# EAGLE design LTC2485Shield (EAGLE 7.4.0)
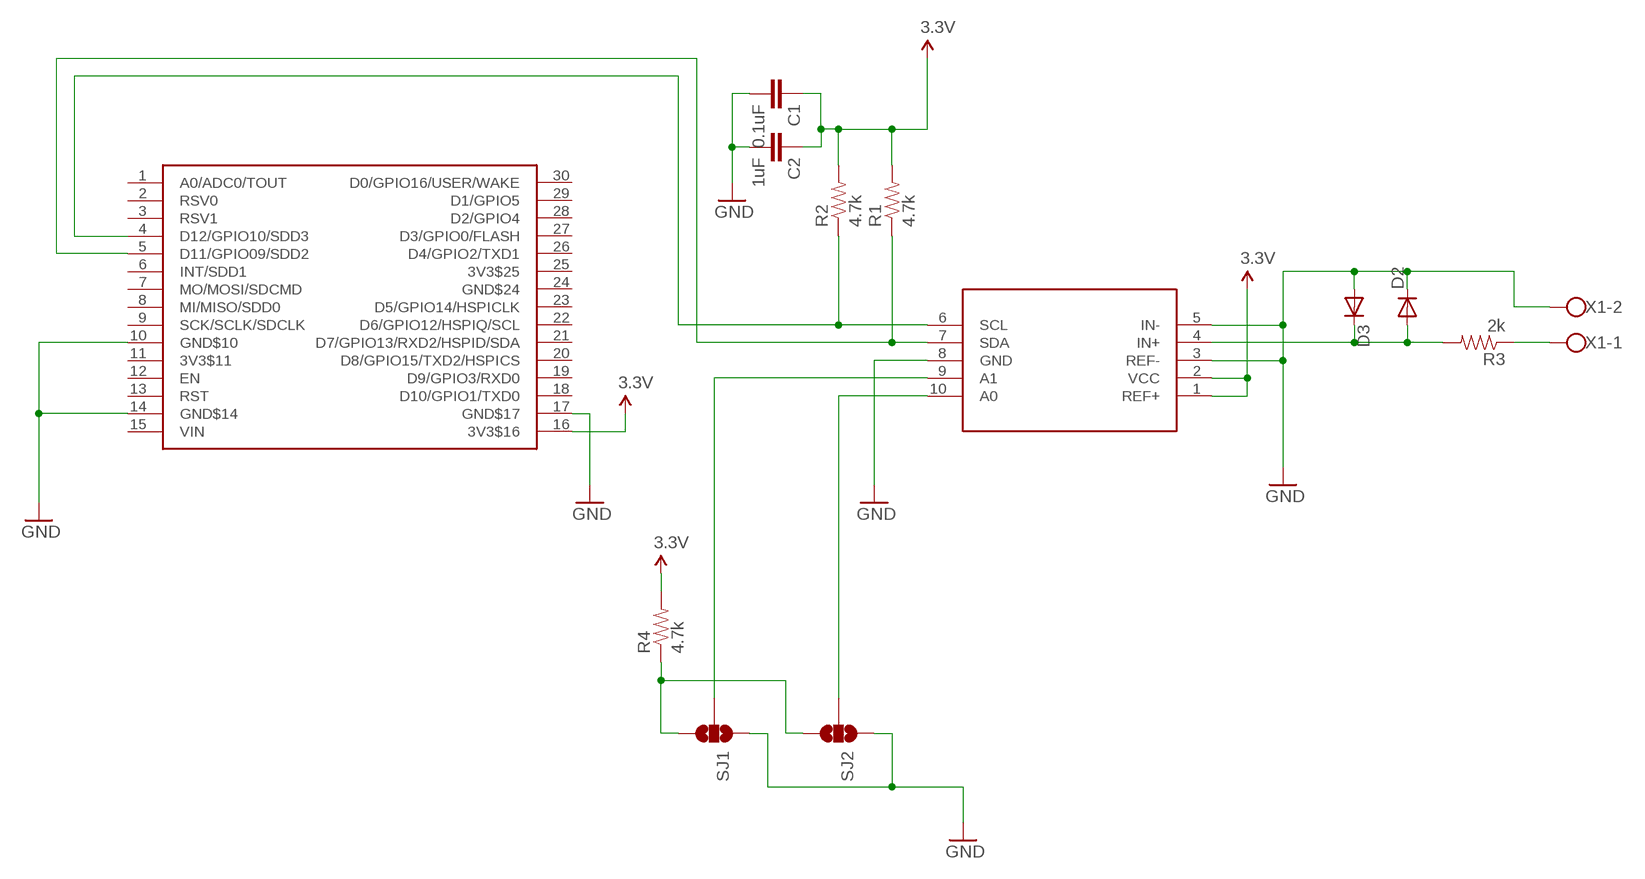
[diagram p0: schematic, sheet 1]

## Parts
C1  0.1uF  CAP0402-CAP  [0402-CAP]
C2  1uF  CAP0402-CAP  [0402-CAP]
D2  DIODESOD  [SOD-323]
D3  DIODESOD  [SOD-323]
R1  4.7k  RESISTOR0402-RES  [0402-RES]
R2  4.7k  RESISTOR0402-RES  [0402-RES]
R3  2k  RESISTOR0402-RES  [0402-RES]
R4  4.7k  RESISTOR0402-RES  [0402-RES]
SJ1  SOLDERJUMPER_2WAYT  [SJ_2]
SJ2  SOLDERJUMPER_2WAYT  [SJ_2]
U$1  NERDSHIELD  [NERDUINO_STACK]
U$2  LTC2485  [DFN10-3X3]
X1  W237-102  [W237-102]

## Nets
3.3V: C1.1 C2.1 R1.2 R2.2 R4.2 U$1.16(3V3$16) U$2.1(REF+) U$2.2(VCC)
GND: C1.2 C2.2 D2.1(C) D3.2(A) SJ1.1 SJ2.1 U$1.10(GND$10) U$1.14(GND$14) U$1.17(GND$17) U$2.3(REF-) U$2.5(IN-) U$2.8(GND) X1.2
N$1: R3.1 X1.1
N$2: R1.1 U$1.5(D11/GPIO09/SDD2) U$2.7(SDA)
N$3: D2.2(A) D3.1(C) R3.2 U$2.4(IN+)
N$6: R4.1 SJ1.3 SJ2.3
N$7: SJ1.2 U$2.9(A1)
N$8: R2.1 U$1.4(D12/GPIO10/SDD3) U$2.6(SCL)
N$9: SJ2.2 U$2.10(A0)
Unconnected: U$1.1(A0/ADC0/TOUT) U$1.2(RSV0) U$1.3(RSV1) U$1.6(INT/SDD1) U$1.7(MO/MOSI/SDCMD) U$1.8(MI/MISO/SDD0) U$1.9(SCK/SCLK/SDCLK) U$1.11(3V3$11) U$1.12(EN) U$1.13(RST) U$1.15(VIN) U$1.18(D10/GPIO1/TXD0) U$1.19(D9/GPIO3/RXD0) U$1.20(D8/GPIO15/TXD2/HSPICS) U$1.21(D7/GPIO13/RXD2/HSPID/SDA) U$1.22(D6/GPIO12/HSPIQ/SCL) U$1.23(D5/GPIO14/HSPICLK) U$1.24(GND$24) U$1.25(3V3$25) U$1.26(D4/GPIO2/TXD1) U$1.27(D3/GPIO0/FLASH) U$1.28(D2/GPIO4) U$1.29(D1/GPIO5) U$1.30(D0/GPIO16/USER/WAKE)

## Library data of the parts
C1 C2 = SparkFun:CAP: Capacitor Standard 0603 ceramic capacitor, and 0.1" leaded capacitor.
D2 D3 = SparkFun:DIODE: Diode These are standard reverse protection diodes and small signal diodes. SMA package can handle up to about 1A. SOD-323 can handle about 200mA. What the SOD-323 package when ordering, there are some mfgs out there that are 5-pin packages.
R1-R4 = SparkFun:RESISTOR: Resistor Basic schematic elements and footprints for 0603, 1206, and PTH resistors.
SJ1 SJ2 = SparkFun:SOLDERJUMPER_2WAY: Solder Jumper 2 way solder jumper
U$1 = NerduinoShieldLib:NERDSHIELD
U$2 = linear-technology:LTC2485
X1 = con-wago-500:W237-102: WAGO SCREW CLAMP; MPN: 237-102; OC_FARNELL: unknown; OC_NEWARK: 70K9898

## Board
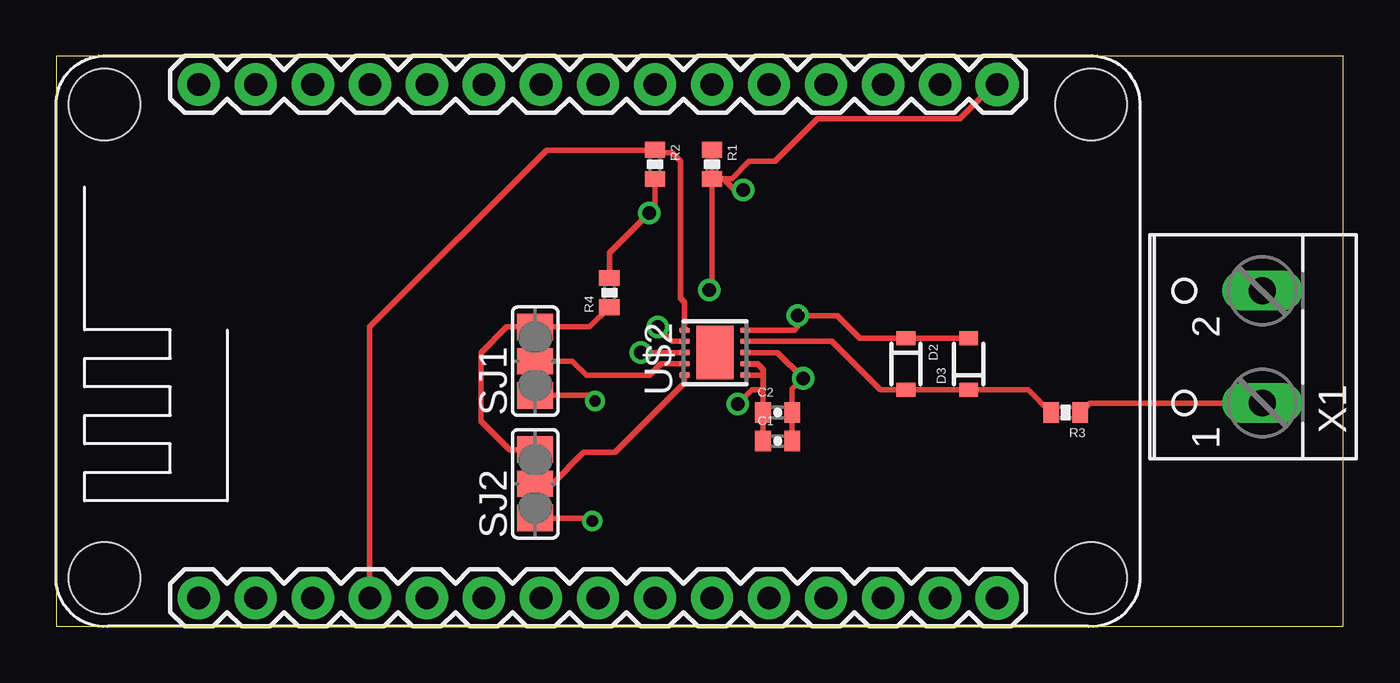
[diagram p1: board, top side]
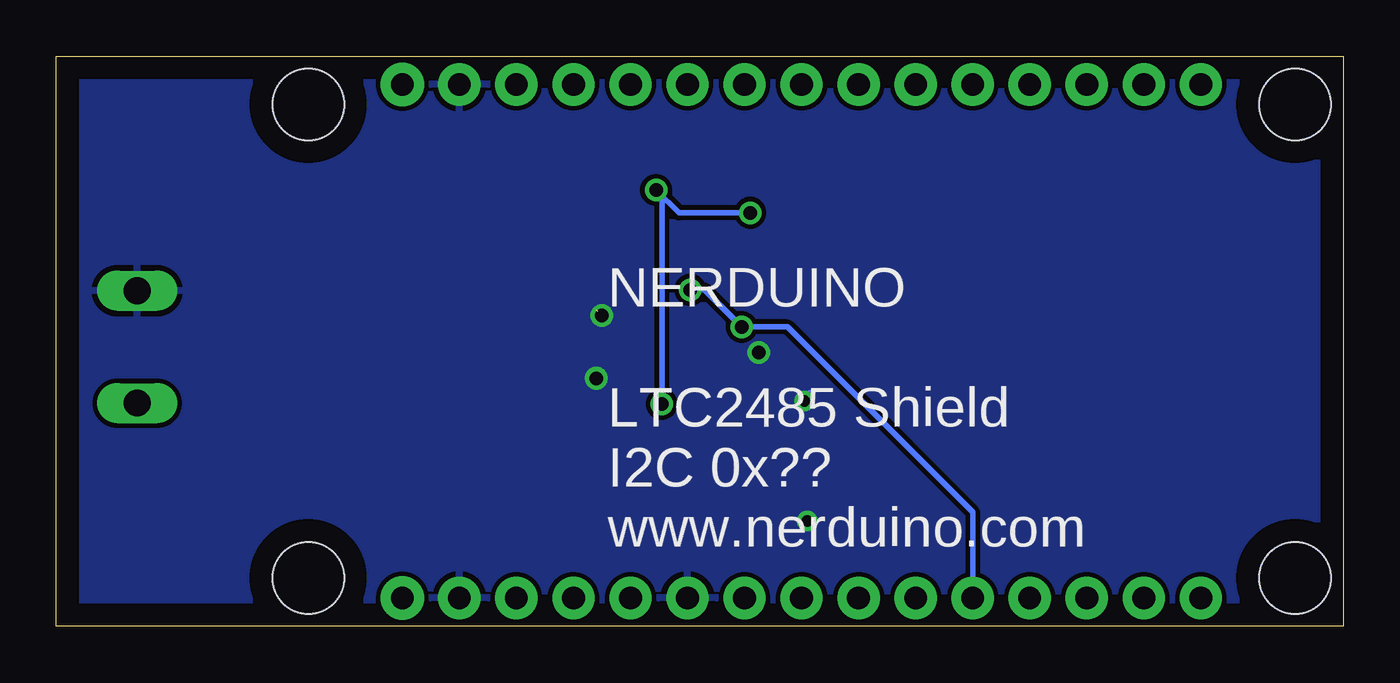
[diagram p2: board, bottom side, seen from below]

Size 57.33 x 25.39 mm. Coordinates in mm from the lower left corner, seen from the top.
Outline: 0,0 57.33,0 57.33,25.39 0,25.39 0,0
Copper layers (1*16): Top 0.035mm / dielectric 1.5mm / Bottom 0.035mm
Design rules "default": minimum track width 10mil, minimum drill 24mil, track to track 8mil, track to pad 8mil, pad to pad 8mil, via to via 8mil, smd to smd 8mil, copper to edge 40mil, drill to drill 8mil, minimum pad ring 10mil, minimum via ring 8mil, stop-mask expansion 4mil, vias tented up to drill 0mil, thermal gap 10mil

### Footprints (pad centres in the part's own frame; a part is rotated, then mirrored left to right if it is on the bottom)
0402-CAP = smd 0.7 x 0.9: 1 -0.65,0; 2 0.65,0
SOD-323 = smd 0.63 x 0.83: 1 -1.15,0; 2 1.15,0
0402-RES = smd 0.7 x 0.9: 1 -0.65,0; 2 0.65,0
SJ_2 = smd 1.168 x 1.6: 1 -1.524,0; 2 0,0; 3 1.524,0
NERDUINO_STACK = drill 1.016 pad 1.88: 1 -17.78,-5.08; 2 -15.24,-5.08; 3 -12.7,-5.08; 4 -10.16,-5.08; 5 -7.62,-5.08; 6 -5.08,-5.08; 7 -2.54,-5.08; 8 0,-5.08; 9 2.54,-5.08; 10 5.08,-5.08; 11 7.62,-5.08; 12 10.16,-5.08; 13 12.7,-5.08; 14 15.24,-5.08; 17 15.24,17.78; 18 12.7,17.78; 19 10.16,17.78; 20 7.62,17.78; 21 5.08,17.78; 22 2.54,17.78; 23 0,17.78; 24 -2.54,17.78; 25 -5.08,17.78; 26 -7.62,17.78; 27 -10.16,17.78; 28 -12.7,17.78; 29 -15.24,17.78; 30 -17.78,17.78 | drill 1 pad 1.93: 15 17.78,-5.08; 16 17.78,17.78 | hole 3.175: -21.971,16.891; -21.971,-4.191; 21.971,-4.191; 21.971,16.891
DFN10-3X3 = smd 0.25 x 0.45: 1 -1,-1.35; 2 -0.5,-1.35; 3 0,-1.35; 4 0.5,-1.35; 5 1,-1.35; 6 1,1.35; 7 0.5,1.35; 8 0,1.35; 9 -0.5,1.35; 10 -1,1.35 | smd 2.38 x 1.65: EXP 0,0
W237-102 = drill 1.194 long: 1 -2.5,-1.27; 2 2.5,-1.27

### Placement (x,y rotation side)
C1  32.13,8.25 0 top
C2  32.13,9.52 0 top
D2  37.85,11.68 270 top
D3  40.64,11.68 90 top
R1  29.21,20.57 270 top
R2  26.67,20.57 270 top
R3  44.96,9.52 180 top
R4  24.64,14.86 90 top
SJ1  21.34,11.81 90 top
SJ2  21.34,6.35 90 top
U$1  24.13,6.35 0 top
U$2  29.34,12.19 90 top
X1  52.45,12.45 90 top

### Tracks (layer width: path | path; a pad name or v marks a point on that pad's centre or on a via)
3.3V  (via drill 0.6)
  Top 0.254: U$1.16 41.78,24.13 40.26,22.61 33.91,22.61 32,20.7 30.86,20.7 30.1,19.94 29.72,19.94 | C1.1 C2.1 31.48,11.18 | 29.72,19.94 29.23,19.94 R1.2 29.21,19.94 | 31.48,11.18 31.48,11.44 31.24,11.68 30.7,11.68 U$2.2 31.23,11.69 31.5,11.43 31.5,10.54 30.99,10.54 v30.35,9.91 | U$2.1 31.46,11.19 31.48,11.18 | v30.61,19.43 30.23,19.43 29.72,19.94 | R2.2 26.67,18.67 v26.42,18.42 24.64,16.64 R4.2
  Bottom 0.254: v30.35,9.91 30.35,19.18 v30.61,19.43 29.59,18.42 v26.42,18.42
GND  (via drill 0.5, 0.6)  (1 unrouted)
  Top 0.254: D3.2 D2.1 35.81,12.83 34.8,13.84 33.4,13.84 33.21,14.03 | C1.2 C2.2 32.78,10.56 v33.27,11.05 32.13,12.19 U$2.3 | U$2.8 v26.04,12.19 | U$2.5 32.88,13.19 33.02,13.33 v33.02,13.84 | SJ1.1 23.75,10.29 v24,10.03 | SJ2.1 23.75,4.83 v23.88,4.7
  Bottom 0.254: v26.04,12.19 25.78,12.19 | v33.27,11.05 33.15,10.79 | v33.02,13.84 33.27,14.1 | v24,10.03 24,10.16 23.75,10.41 | v23.88,4.7 23.88,4.83 24,4.95
  pour Bottom: 0.13,25.27 57.02,25.27 57.02,0.13 0.13,0.13
N$1
  Top 0.254: X1.1 46.03,9.95 R3.1
N$2  (via drill 0.6)
  Top 0.254: R1.1 29.21,15.11 v29.08,14.99 | U$2.7 27.43,12.7 v26.8,13.33
  Bottom 0.254: v29.08,14.99 28.45,14.99 v26.8,13.33 24.77,13.33 16.51,5.08 U$1.5
N$3
  Top 0.254: R3.2 43.3,10.53 D3.1 D2.2 36.7,10.54 34.55,12.69 U$2.4
N$6
  Top 0.254: R4.1 23.76,13.33 SJ1.3 20.07,13.33 18.92,12.19 18.92,9.14 20.19,7.87 SJ2.3
N$7
  Top 0.254: U$2.9 26.93,11.69 26.42,11.18 23.62,11.18 22.99,11.81 SJ1.2
N$8
  Top 0.254: U$2.6 27.99,14.43 27.81,14.6 27.81,20.7 27.43,21.08 26.81,21.08 R2.1 26.66,21.21 21.84,21.21 13.97,13.33 U$1.4
N$9
  Top 0.254: U$2.10 27.99,10.84 24.89,7.75 23.5,7.75 22.1,6.35 SJ2.2

### Text on the board
_bsilk: NERDUINO / / LTC2485 Shield / I2C 0x?? / www.nerduino.com